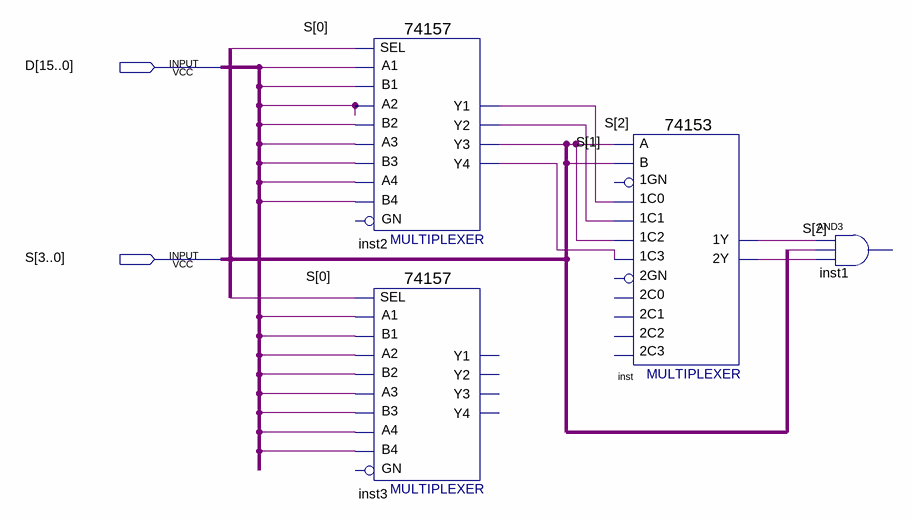
[diagram p0: schematic sheet]
// Quartus schematic Problema3.bdf as structural Verilog: 4 symbols, 2 pins
module Problema3 (
  input  [15:0] D,
  input  [3:0] S
);

  wire inst2_y1, inst2_y2, inst2_y4, inst_1y, inst_2y, undriven, undriven_2, undriven_3, undriven_4,
       undriven_5, undriven_6, undriven_7, undriven_8, undriven_9, undriven_10, undriven_11, undriven_12,
       undriven_13, undriven_14, undriven_15, undriven_16;

  \74157  inst2 (
    .A1(undriven), .B1(undriven_2), .SEL(S[0]), .B2(undriven_4), .A3(undriven_5), .B3(undriven_6),
    .A2(undriven_3), .B4(undriven_8), .A4(undriven_7), .Y2(inst2_y2), .Y1(inst2_y1), .Y4(inst2_y4), .Y3(S[2]));  // open: GN
  \74157  inst3 (
    .A1(undriven_9), .B1(undriven_10), .SEL(S[0]), .B2(undriven_12), .A3(undriven_13), .B3(undriven_14),
    .A2(undriven_11), .B4(undriven_16), .A4(undriven_15));  // open: GN, Y2, Y1, Y4, Y3
  \74153  inst (
    .\1C1 (inst2_y2), .\1C0 (inst2_y1), .\1C2 (S[2]), .\1C3 (inst2_y4), .B(S[1]), .A(S[2]), .\1Y (inst_1y),
    .\2Y (inst_2y));  // open: 1GN, 2C0, 2GN, 2C2, 2C1, 2C3
  // AND3 inst1 has open pins: IN1=inst_1y, IN2=S[2], IN3=inst_2y, OUT=open
endmodule
